# Altium schematic sheet MCU_1.SchDoc
size A4
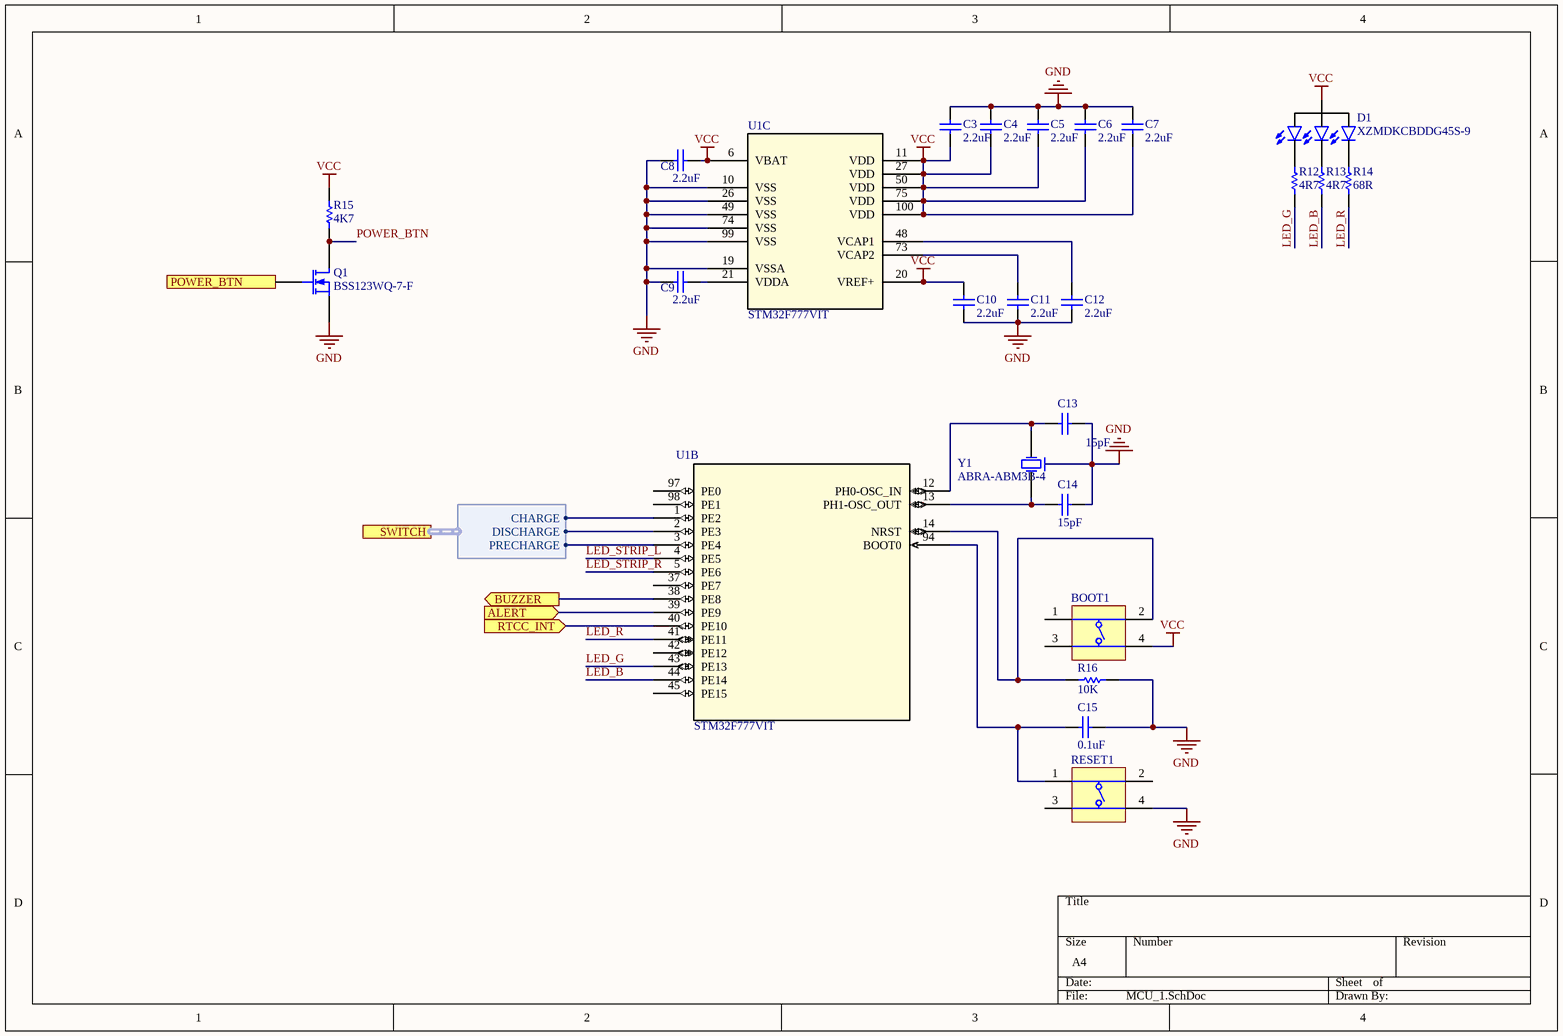
[diagram p0: MCU_1.SchDoc]

## Parts
BOOT1  (no value)  [SWITCH]
C3  value 2.2uF  [C0402[1005X55]]  (hidden comment: 2.2uF 6.3V 0402)
C4  value 2.2uF  [C0402[1005X55]]  (hidden comment: 2.2uF 6.3V 0402)
C5  value 2.2uF  [C0402[1005X55]]  (hidden comment: 2.2uF 6.3V 0402)
C6  value 2.2uF  [C0402[1005X55]]  (hidden comment: 2.2uF 6.3V 0402)
C7  value 2.2uF  [C0402[1005X55]]  (hidden comment: 2.2uF 6.3V 0402)
C8  value 2.2uF  [C0402[1005X55]]  (hidden comment: 2.2uF 6.3V 0402)
C9  value 2.2uF  [C0402[1005X55]]  (hidden comment: 2.2uF 6.3V 0402)
C10  value 2.2uF  [C0402[1005X55]]  (hidden comment: 2.2uF 6.3V 0402)
C11  value 2.2uF  [C0402[1005X55]]  (hidden comment: 2.2uF 6.3V 0402)
C12  value 2.2uF  [C0402[1005X55]]  (hidden comment: 2.2uF 6.3V 0402)
C13  value 15pF  [C0402[1005X55]]  (hidden comment: 15pF 50V 0402)
C14  value 15pF  [C0402[1005X55]]  (hidden comment: 15pF 50V 0402)
C15  value 0.1uF  [C0402[1005X55]]  (hidden comment: 0.1uF 6.3V 0402)
D1  XZMDKCBDDG45S-9  [XZMDKCBDDG45S-9]
Q1  BSS123WQ-7-F  [SOT323-3]
R12  value 4R7  [R0402[1005]]  (hidden comment: 4R7 1% 0402)
R13  value 4R7  [R0402[1005]]  (hidden comment: 4R7 1% 0402)
R14  value 68R  [R0402[1005]]  (hidden comment: 68R 1% 0402)
R15  value 4K7  [R0402[1005]]  (hidden comment: 4K7 1% 0402)
R16  value 10K  [R0402[1005]]  (hidden comment: 10K 1% 0402)
RESET1  (no value)  [SWITCH]
U1  STM32F777VIT  [LQFP-100_14X14mm]  (parts B,C of 3)
Y1  ABRA-ABM3B-4  [ABRA-ABM3B-4_V]

## Ports
ALERT (in), BUZZER (out), POWER_BTN (in), RTCC_INT (in), SWITCH (harness Switches)

## Harnesses
Switches: CHARGE, DISCHARGE, PRECHARGE

## Nets
GND: C3.1 C4.1 C5.1 C6.1 C7.1 C8.2 C9.2 C10.2 C11.2 C12.2 C13.1 C14.1 C15.2 Q1.2(S) R16.2 RESET1.4(T3) U1.10(VSS) U1.19(VSSA) U1.26(VSS) U1.49(VSS) U1.74(VSS) U1.99(VSS) Y1.2
VCC: BOOT1.4(T3) C3.2 C4.2 C5.2 C6.2 C7.2 C8.1 C10.1 D1.2(A) R15.2 U1.6(VBAT) U1.11(VDD) U1.20(VREF+) U1.27(VDD) U1.50(VDD) U1.75(VDD) U1.100(VDD)
ALERT: U1.39(PE9) ; port ALERT
BUZZER: U1.38(PE8) ; port BUZZER
LED_B: R13.1 U1.44(PE14)
LED_G: R12.1 U1.43(PE13)
LED_R: R14.1 U1.41(PE11)
LED_STRIP_L: U1.4(PE5)
LED_STRIP_R: U1.5(PE6)
POWER_BTN: Q1.3(D) R15.1
POWER_BTN: Q1.1(G) ; port POWER_BTN  [a separate net that carries the same name]
RTCC_INT: U1.40(PE10) ; port RTCC_INT
NetBOOT1_2: BOOT1.2(T2) R16.1 U1.14(NRST)
NetC9_1: C9.1 U1.21(VDDA)
NetC11_1: C11.1 U1.73(VCAP2)
NetC12_1: C12.1 U1.48(VCAP1)
NetC13_2: C13.2 U1.12(PH0-OSC_IN) Y1.3(X2)
NetC14_2: C14.2 U1.13(PH1-OSC_OUT) Y1.1(X1)
NetC15_1: C15.1 RESET1.1(T1) U1.94(BOOT0)
NetD1_1: D1.1(K_Red) R14.2
NetD1_3: D1.3(K_Blue) R13.2
NetD1_4: D1.4(K_Green) R12.2
NetU1_1: U1.1(PE2) ; port SWITCH.CHARGE
NetU1_2: U1.2(PE3) ; port SWITCH.DISCHARGE
NetU1_3: U1.3(PE4) ; port SWITCH.PRECHARGE

Not connected (* = marked no-connect by the designer): BOOT1 1(T1) 3(T3); RESET1 2(T2) 3(T3); U1 37(PE7) 42(PE12) 45(PE15) 97(PE0) 98(PE1)

## Library data of the parts
BOOT1 RESET1 = DIPT-DTSM-6: Switch, SPNO Push Button SMD; Manufacturer: C&K Components; PartNumber: PTS810 SJM 250 SMTR LFS; Packing Type: Tape&Reel; Mechanical Life: 200,000 cycles; ComponentLink2URL: http://www.dip.com.tw/Products_tact.htm; ComponentLink1URL: http://www.dip.com.tw/; ComponentLink3URL: http://www.dip.com.tw/PDF/pro_tact/DTSM_G_-6_2_-V.pdf; PackageDescription: Switch, Surface Mount, 4 Leads, Body 4.6x2.8mm, Height 1.9mm; ComponentLink2Description: Datasheet; ComponentLink3Description: Package Specification; ComponentLink1Description: Manufacturer URL; PackageReference: PTS810; Mounting Technology: Surface Mount
C3-C12 = CAP_2.2uF_6.3V_0402_20%: 2.2uF 6.3V 20% 0402 (1005 Metric); PartNumber: GRM155R60J225ME15D; Manufacturer: Murata; Tolerance: 20%; Mounting Technology: Surface Mount; PackageReference: 0402; PackageDescription: 0402 (1005 Metric); Voltage: 6.3V
C13 C14 = CAP_15pF_50V_0402_5%: 15pF 50V 5% 0402 (1005 Metric); PartNumber: GRM1555C1H150JA01D; Manufacturer: Murata; Tolerance: 5%; Mounting Technology: Surface Mount; PackageReference: 0402; PackageDescription: 0402 (1005 Metric); Voltage: 50V
C15 = CAP_0.1uF_6.3V_0402_10%: 0.1uF 6.3V 10% 0402 (1005 Metric); PartNumber: GRM155R70J104KA01D; Manufacturer: Murata; Tolerance: 10%; Mounting Technology: Surface Mount; PackageReference: 0402; PackageDescription: 0402 (1005 Metric); Voltage: 6.3V
D1 = XZMDKCBDDG45S-9: Manufacturer: SunLED; PartNumber: XZMDKCBDDG45S-9; PackageReference: 4-PLCC; Mounting Technology: Surface Mount; PackageDescription: 4-SMD, Gull Wing,  3.20mm L x 2.80mm W
Q1 = BSS123WQ-7-F: N-Channel MOSFET; Manufacturer: Diodes Incorporated; PackageReference: SOT-323-3; PartNumber: BSS123WQ-7-F; Mounting Technology: Surface Mount
R12 R13 = RES_4R7_0402_1%: 4R7 0.063W 1% 0402 (1005 Metric); Manufacturer: KOA Speer; PartNumber: RK73H1ETTP4R70F; Power: 0.063W; Tolerance: 1%; Mounting Technology: Surface Mount; PackageReference: 0402; PackageDescription: 0402 (1005 Metric); ComponentLink1Description: Datasheet; ComponentLink1URL: http://www.koaspeer.com/catimages/Products/RK73H/RK73H.pdf
R14 = RES_68R_0402_1%: 68R 0.063W 1% 0402 (1005 Metric); Manufacturer: KOA Speer; PartNumber: RK73H1ETTP68R0F; Tolerance: 1%; Power: 0.063W; Mounting Technology: Surface Mount; PackageReference: 0402; PackageDescription: 0402 (1005 Metric); ComponentLink1Description: Datasheet; ComponentLink1URL: http://www.koaspeer.com/catimages/Products/RK73H/RK73H.pdf
R15 = RES_4K7_0402_1%: 4K7 0.063W 1% 0402 (1005 Metric); Manufacturer: KOA Speer; PartNumber: RK73H1ETTP4701F; Tolerance: 1%; Power: 0.063W; Mounting Technology: Surface Mount; PackageReference: 0402; PackageDescription: 0402 (1005 Metric); ComponentLink1Description: Datasheet; ComponentLink1URL: http://www.koaspeer.com/catimages/Products/RK73H/RK73H.pdf
R16 = RES_10K_0402_1%: 10K 0.063W 1% 0402 (1005 Metric); Manufacturer: KOA Speer; PartNumber: RK73H1ETTP1002F; Tolerance: 1%; Power: 0.063W; Mounting Technology: Surface Mount; PackageReference: 0402; PackageDescription: 0402 (1005 Metric); ComponentLink1Description: Datasheet; ComponentLink1URL: http://www.koaspeer.com/catimages/Products/RK73H/RK73H.pdf
U1 = STM32F777VIT: Imported; Manufacturer_Part_Number: stm32f77xvxt; Vendor: STMicroelectronics; C: Copyright (C) 2016 Accelerated Designs. All rights reserved; Copyright: Copyright (C) 2016 Accelerated Designs. All rights reserved; Value: Value; Type: Type; RefDes: RefDes
Y1 = ABRA-ABM3B-4: PartNumber: ABM3B-8.000MHZ-10-1UT; Manufacturer: ABRACON; Mounting Technology: Surface Mount; PackageReference: 2012; PackageDescription: 2012 (5032 metric)